# Altium schematic sheet FM.SchDoc
size A4; SheetNumber: 1; SheetTotal: 1; SPICEModelCacheOTPBXTPI: <root> / <DocumentId>OTPBXTPI</DocumentId> / <CacheFrame Number="0"> / <Model Name="s9014" Kind="MDL"> / <Text>.MODEL S9014 NPN ( / + IS=2.68E-14 BF=320 NF=1.0 VAF=80 IKR=0.14 / + ISE=1.2E-14 NE=1.5 BR=4 NR=1.0 VAR=20 / + IKR=0.01 ISC=0 NC=2 RB=10 IRB=0.1 / + RBM=1 RE=0.4 RC=0.8 CJE=2.2E-11 VJE=0.75 / + MJE=0.33 CJC=7.5E-12 VJC=0.75 MJC=0.33 / + TF=5E-10 TR=1E-8 EG=1.11 XTI=3 VCEO=45 / + ICRATING=100m mfg=Fairchild)</Text> / </Model> / <Model Name="s9018" Kind="MDL"> / <Text>.MODEL S9018 NPN ( / + IS=3f XCJC=0.1 XTI=3 VAF=75 BF=102 NE=2 / + ISE=0.8p IKF=250m XTB=1.5 BR=0.3 NC=2 / + ISC=0.8p IKR=10m RC=3.5 CJC=1.8p MJC=0.15 / + VJC=0.8 FC=0.5 CJE=1.5p MJE=0.5 VJE=0.8 / + TR=2n TF=110p ITF=13m VTF=1.7 XTF=3 / + RB=60 VCEO=15 ICRATING=50m mfg=Fairchild)</Text> / </Model> / </CacheFrame> / </root>
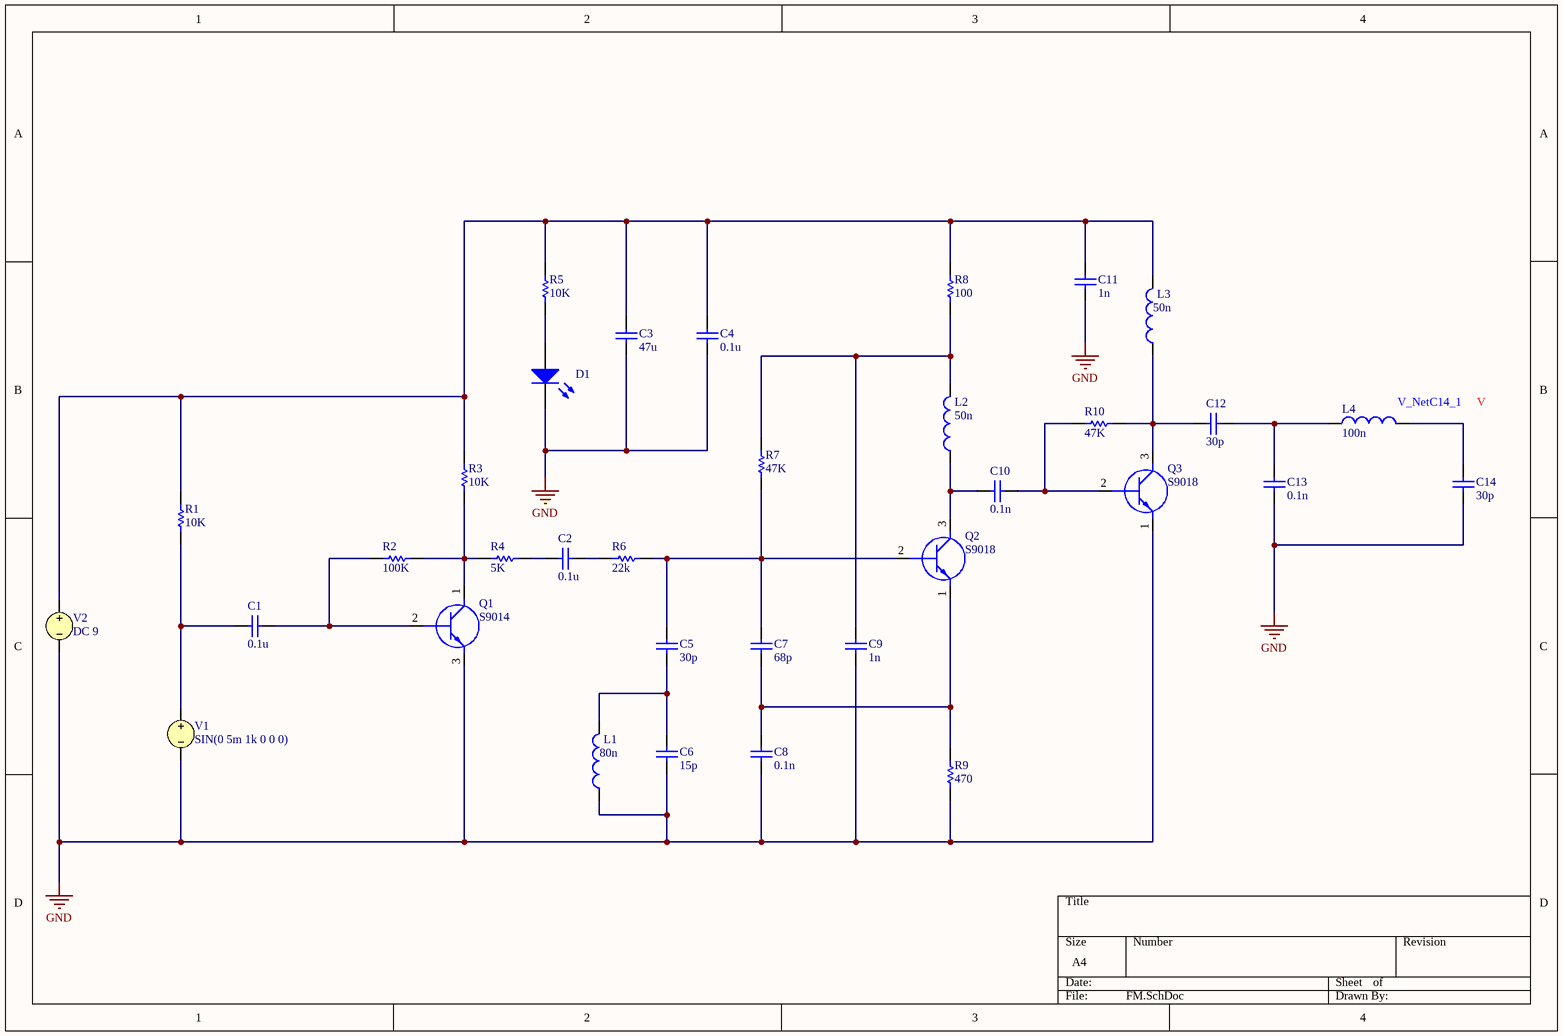
[diagram p0: FM.SchDoc]

## Parts
C1  value 0.1u  (hidden comment: Capacitor)
C2  value 0.1u  (hidden comment: Capacitor)
C3  value 47u  (hidden comment: Capacitor)
C4  value 0.1u  (hidden comment: Capacitor)
C5  value 30p  (hidden comment: Capacitor)
C6  value 15p  (hidden comment: Capacitor)
C7  value 68p  (hidden comment: Capacitor)
C8  value 0.1n  (hidden comment: Capacitor)
C9  value 1n  (hidden comment: Capacitor)
C10  value 0.1n  (hidden comment: Capacitor)
C11  value 1n  (hidden comment: Capacitor)
C12  value 30p  (hidden comment: Capacitor)
C13  value 0.1n  (hidden comment: Capacitor)
C14  value 30p  (hidden comment: Capacitor)
D1  Light-Emitting Diode  (value not drawn)
L1  value 80n  (hidden comment: Inductor)
L2  value 50n  (hidden comment: Inductor)
L3  value 50n  (hidden comment: Inductor)
L4  value 100n  (hidden comment: Inductor)
Q1  S9014  [S9014]
Q2  S9018  [S9018]
Q3  S9018  [S9018]
R1  value 10K  (hidden comment: Resistor)
R2  value 100K  (hidden comment: Resistor)
R3  value 10K  (hidden comment: Resistor)
R4  value 5K  (hidden comment: Resistor)
R5  value 10K  (hidden comment: Resistor)
R6  value 22k  (hidden comment: Resistor)
R7  value 47K  (hidden comment: Resistor)
R8  value 100  (hidden comment: Resistor)
R9  value 470  (hidden comment: Resistor)
R10  value 47K  (hidden comment: Resistor)
V1  SIN(0 5m 1k 0 0 0)
V2  DC 9

## Nets
GND: C3.1 C4.1 C6.1 C8.1 C9.1 C11.1 C13.2 C14.2 D1.2(K) L1.1 Q1.3(E) Q3.1(E) R9.2 V1.2 V2.2
NetC1_1: C1.1 R1.1 V1.1
NetC1_2: C1.2 Q1.2(B) R2.1
NetC2_1: C2.1 R4.1
NetC2_2: C2.2 R6.2
NetC3_2: C3.2 C4.2 C11.2 L3.2 R1.2 R3.2 R5.1 R8.1 V2.1
NetC5_1: C5.1 C6.2 L1.2
NetC5_2: C5.2 C7.2 Q2.2(B) R6.1 R7.2
NetC7_1: C7.1 C8.2 Q2.1(E) R9.1
NetC9_2: C9.2 L2.2 R7.1 R8.2
NetC10_1: C10.1 Q3.2(B) R10.1
NetC10_2: C10.2 L2.1 Q2.3(C)
NetC12_1: C12.1 C13.1 L4.1
NetC12_2: C12.2 L3.1 Q3.3(C) R10.2
NetC14_1: C14.1 L4.2
NetD1_1: D1.1(A) R5.2
NetQ1_1: Q1.1(C) R2.2 R3.1 R4.2

## Library data of the parts
C1-C14 = Capacitor: SimulationGenericComponent: True
D1 = LED: AF: 1; BV: 0; BV_MAX: 1e99; EG: 1.11; FC: 0.5; IBV: 0.001; IS: 1e-14; MJSW: 0.33; NTUN: 30; TNOM: 27; XTI: 3; SimulationGenericComponent: True; CJO: 0; CJP: 0; CTA: 0; CTP: 0; FCS: 0.5; FV_MAX: 1e99; IKF: 0; IKR: 0; ISR: 1e-14; JSW: 0; JTUN: 0; JTUNSW: 0; KEG: 1; KF: 0; LEVEL: 1; N: 1; NBV: 1; NR: 1; NS: 1; PHP: 1; RS: 0; TCV: 0; TLEV: 0; TLEVC: 0; TM1: 0; TM2: 0; TPB: 0; TPHP: 0; TRS: 0; TRS2: 0; TT: 0; TTT1: 0; TTT2: 0; VJ: 1; XTITUN: 3
L1-L4 = Inductor: SimulationGenericComponent: True
Q1 = S9014: Transistor BJT NPN; Manufacturer_Name: MCC; Datasheet Link: https://datasheet.datasheetarchive.com/originals/distributors/Datasheets-19/DSA-361985.pdf; Height: 4.83mm; Manufacturer_Part_Number: S9014
Q2 Q3 = S9018: Transistor BJT NPN; Manufacturer_Name: MCC; Datasheet Link: https://4donline.ihs.com/images/VipMasterIC/IC/MCCC/MCCCS03255/MCCCS03255-1.pdf?hkey=EF798316E3902B6ED9A73243A3159BB0; Manufacturer_Part_Number: S9018
R1-R10 = Resistor: TC1: 0; SimulationGenericComponent: True; TC2: 0
V1 = VSRC: Voltage Source; Note: PCB Footprint - Not required; AC Magnitude: 1; AC Phase: 0; DC Magnitude: 5; Published: 8-Jun-2000; LatestRevisionDate: 17-Jul-2002; LatestRevisionNote: Re-released for DXP Platform.; PackageReference: Not Applicable; Publisher: Altium Limited; Offset: 0; Amplitude: 5m; Frequency: 1k; Delay: 0; Damping Factor: 0; Phase: 0
V2 = VSRC: Voltage Source; Note: PCB Footprint - Not required; AC Magnitude: 1; AC Phase: 0; Value: 9; Published: 8-Jun-2000; LatestRevisionDate: 17-Jul-2002; LatestRevisionNote: Re-released for DXP Platform.; PackageReference: Not Applicable; Publisher: Altium Limited